# Altium schematic sheet 2015PCB新.SchDoc
size A3
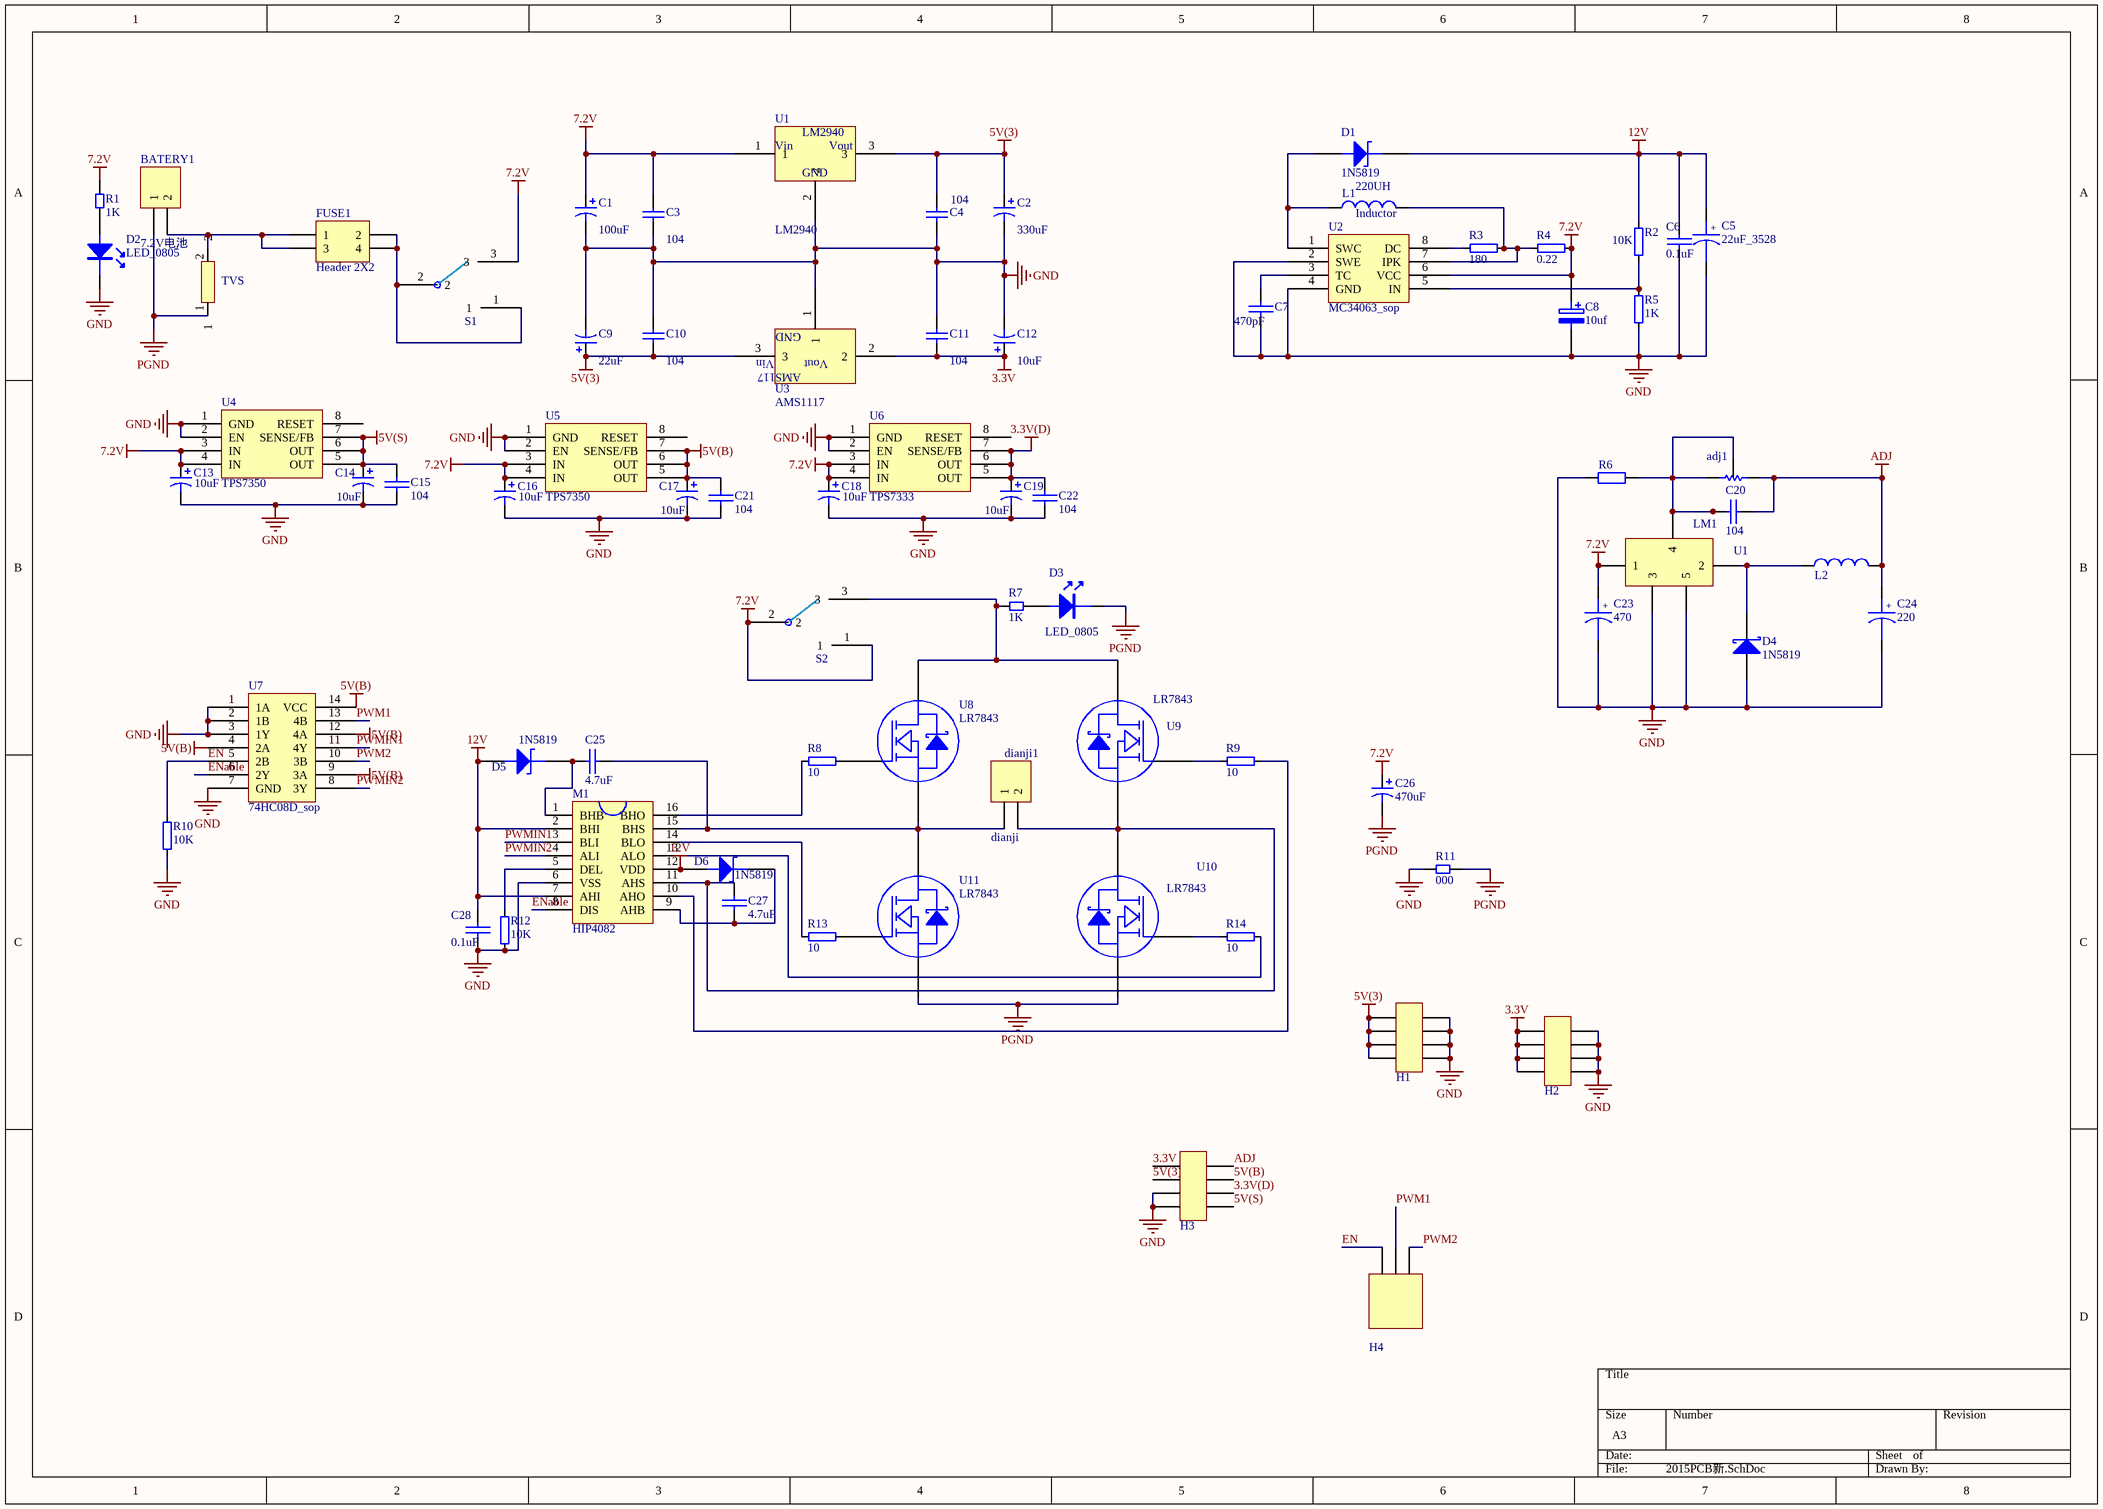
[diagram p0: 2015PCB新.SchDoc]

## Parts
adj1  RISISTR_ADJ  [RISIATER_ADJ]  (value not drawn)
BATERY1  7.2V电池  [PCBComponent_1]
C1  value 100uF  [PCBComponent_1]  (hidden comment: Cap Pol1_1)
C2  value 330uF  [PCBComponent_1]  (hidden comment: Cap Pol1_1)
C3  value 104  [PCBComponent_1]  (hidden comment: Cap)
C4  value 104  [PCBComponent_1]  (hidden comment: Cap)
C5  22uF_3528  [3528_B]
C6  0.1uF  [0805]
C7  470pF  [0805]
C8  10uf  [1206]
C9  value 22uF  [PCBComponent_1]  (hidden comment: Cap Pol1_1)
C10  value 104  [PCBComponent_1]  (hidden comment: Cap)
C11  value 104  [PCBComponent_1]  (hidden comment: Cap)
C12  value 10uF  [PCBComponent_1]  (hidden comment: Cap Pol1_1)
C13  10uF  [1206]
C14  10uF  [1206]
C15  104  [c0805]
C16  10uF  [1206]
C17  10uF  [1206]
C18  10uF  [1206]
C19  10uF  [1206]
C20  104  [0805]
C21  104  [c0805]
C22  104  [c0805]
C23  470  [PCBComponent_1]
C24  220  [PCBComponent_1]
C25  4.7uF  [0805]
C26  value 470uF  [PCBComponent_1]  (hidden comment: Cap Pol1_1)
C27  4.7uF  [0805]
C28  0.1uF  [0805]
D1  1N5819  [SS14_SMA]
D2  LED_0805  [0805]
D3  LED_0805  [0805]
D4  1N5819  [1N5819]
D5  1N5819  [SS14_SMA]
D6  1N5819  [SS14_SMA]
dianji1  dianji  [PCBComponent_1]
erjiguan1  TVS  [1812]
FUSE1  Header 2X2  [PCBComponent_1]
H1  HEADER4X2  [HEADER4X2]  (value not drawn)
H2  HEADER4X2  [HEADER4X2]  (value not drawn)
H3  HEADER4X2  [HEADER4X2]  (value not drawn)
H4  HEADER  [干簧管]  (value not drawn)
L1  Inductor  value 220UH  [PCBComponent_1]
L2  L?  [7*7*4]  (value not drawn)
LM1  U1  [LM2596]
M1  HIP4082  [SO-16]
R1  value 1K  [0805]  (hidden comment: RES)
R2  10K  [0805]
R3  180  [0805]
R4  0.22  [0805]
R5  1K  [0805]
R6  Res2  [0805]  (value not drawn)
R7  value 1K  [0805]  (hidden comment: RES)
R8  10  [0805]
R9  10  [0805]
R10  10K  [0805]
R11  value 000  [0805]  (hidden comment: RES)
R12  10K  [0805]
R13  10  [0805]
R14  10  [0805]
S1  单刀双掷开关  [三脚开关]  (value not drawn)
S2  单刀双掷开关  [三脚开关]  (value not drawn)
U1  LM2940  [PCBComponent_1]
U2  MC34063_sop  [SOP-8]
U3  AMS1117  [SOT223_forAMS1117]
U4  TPS7350  [SO-8]
U5  TPS7350  [SO-8]
U6  TPS7333  [SO-8]
U7  74HC08D_sop  [SOP-14]
U8  LR7843  [DPAK]
U9  LR7843  [DPAK]
U10  LR7843  [DPAK]
U11  LR7843  [DPAK]

## Nets
3.3V: C11.1 C12.1 H2.1 H2.2 H2.3 H2.4 H3.1 U3.2
3.3V(D): C19.1 C22.1 H3.6 U6.5(OUT) U6.6(OUT) U6.7(SENSE/FB)
5V(3): C2.1 C4.2 C9.1 C10.1 H1.1 H1.2 H1.3 H1.4 H3.2 U1.3 U3.3
5V(B): C17.1 C21.1 H3.7 U5.5(OUT) U5.6(OUT) U5.7(SENSE/FB) U7.4(2A) U7.9(3A) U7.12(4A) U7.14(VCC)
5V(S): C14.1 C15.1 H3.5 U4.5(OUT) U4.6(OUT) U4.7(SENSE/FB)
7.2V: C1.1 C3.2 C8.1 C13.1 C16.1 C18.1 C23.1 C26.1 LM1.1 R1.1 R4.2 S1.3 S2.1 S2.2 U1.1 U2.6(VCC) U4.3(IN) U4.4(IN) U5.3(IN) U5.4(IN) U6.3(IN) U6.4(IN)
12V: C5.1 C6.1 C28.1 D1.2(K) D5.1(A) D6.1(A) M1.2(BHI) M1.7(AHI) M1.12(VDD) R2.1
ADJ: adj1.3 C20.2 C24.1 H3.8 L2.2
GND: C1.2 C2.2 C3.1 C4.1 C5.2 C6.2 C7.2 C8.2 C9.2 C10.2 C11.2 C12.2 C13.2 C14.2 C15.2 C16.2 C17.2 C18.2 C19.2 C21.2 C22.2 C23.2 C24.2 C28.2 D2.2 D4.1 H1.5 H1.6 H1.7 H1.8 H2.5 H2.6 H2.7 H2.8 H3.3 H3.4 LM1.3 LM1.5 M1.6(VSS) R5.1 R6.1 R10.1 R11.1 R12.1 U1.2 U2.2(SWE) U2.4(GND) U3.1 U4.1(GND) U4.2(EN) U5.1(GND) U5.2(EN) U6.1(GND) U6.2(EN) U7.1(1A) U7.2(1B) U7.3(1Y) U7.7(GND)
PGND: BATERY1.1 C26.2 D3.2 R11.2 U10.3(S) U11.3(S)
EN: H4.3 R10.2 U7.5(2B)
ENable: M1.8(DIS) U7.6(2Y)
PWM1: H4.2 U7.13(4B)
PWM2: H4.1 U7.10(3B)
PWMIN1: M1.3(BLI) U7.11(4Y)
PWMIN2: M1.4(ALI) U7.8(3Y)
Netadj1_1: adj1.1 adj1.2 C20.1 LM1.4 R6.2
NetBATERY1_2: BATERY1.2 FUSE1.1 FUSE1.3
NetC7_1: C7.1 U2.3(TC)
NetC25_1: C25.1 dianji1.1 M1.15(BHS) U8.3(S) U11.2(D)
NetC25_2: C25.2 D5.2(K) M1.1(BHB)
NetC27_1: C27.1 dianji1.2 M1.11(AHS) U9.3(S) U10.2(D)
NetC27_2: C27.2 D6.2(K) M1.9(AHB)
NetD1_1: D1.1(A) L1.1 U2.1(SWC)
NetD2_1: D2.1 R1.2
NetD3_1: D3.1 R7.2
NetD4_2: D4.2 L2.1 LM1.2
NetFUSE1_2: FUSE1.2 FUSE1.4 S1.1 S1.2
NetL1_2: L1.2 R3.2 R4.1 U2.7(IPK)
NetM1_5: M1.5(DEL) R12.2
NetM1_10: M1.10(AHO) R9.2
NetM1_13: M1.13(ALO) R14.2
NetM1_14: M1.14(BLO) R13.1
NetM1_16: M1.16(BHO) R8.1
NetR2_2: R2.2 R5.2 U2.5(IN)
NetR3_1: R3.1 U2.8(DC)
NetR7_1: R7.1 S2.3 U8.2(D) U9.2(D)
NetR8_2: R8.2 U8.1(G)
NetR9_1: R9.1 U9.1(G)
NetR13_2: R13.2 U11.1(G)
NetR14_1: R14.1 U10.1(G)

Not connected (* = marked no-connect by the designer): erjiguan1 1 2; U4 8(RESET); U5 8(RESET); U6 8(RESET)

## Notes on the sheet
- (in symbol 10uF_3528) +
- (in symbol AMS1117) GND; Vin; Vout; AMS117
- (in symbol LM2940) Vin; Vout; GND
- (in symbol P_cap_C_100u) +

## Library data of the parts
BATERY1 dianji1 = Header 2: Header, 2-Pin; LatestRevisionDate: 17-Jul-2002; LatestRevisionNote: Re-released for DXP Platform.; Publisher: Altium Limited
C1 C2 C9 C12 C26 = Cap Pol1_1: Polarized Capacitor (Radial); Published: 8-Jun-2000; LatestRevisionDate: 17-Jul-2002; LatestRevisionNote: Re-released for DXP Platform.; PackageReference: RB7.6-15; Publisher: Altium Limited
C3 C4 C10 C11 = Cap: Capacitor; Published: 8-Jun-2000; LatestRevisionDate: 17-Jul-2002; LatestRevisionNote: Re-released for DXP Platform.; PackageReference: RAD-0.3; Publisher: Altium Limited
C5 = 10uF_3528
C6 C7 C25 C27 C28 = 0.1uF_0805
C8 = ELECTRO2_2: Electrolytic Capacitor
C13 C14 C16-C19 = Cap Pol1: Polarized Capacitor (Radial); Published: 8-Jun-2000; LatestRevisionDate: 17-Jul-2002; LatestRevisionNote: Re-released for DXP Platform.; PackageReference: RB7.6-15; Publisher: Altium Limited; Value: 10uF
C15 C21 C22 = CAP: Capacitor
C20 = CAP_1: Capacitor
C23 C24 = P_cap_C_100u
D1 D5 D6 = 1N5819_SMA
erjiguan1 = Component_1
FUSE1 = Header 2X2: Header, 2-Pin, Dual row; LatestRevisionDate: 17-Jul-2002; LatestRevisionNote: Re-released for DXP Platform.; Publisher: Altium Limited
H4 = HEADER3
L1 = Inductor: Code_IEC: 1005; Published: 8-Jun-2000; LatestRevisionDate: 29-May-2009; LatestRevisionNote: IPC-7351 Footprint Added.; PackageReference: 0402-A; Publisher: Altium Limited; PackageDescription: Chip Inductor; Code_JEITA: 0402
L2 = 33Uinductor774
LM1 = LM2596
R1 R7 R11 = 0805-电阻
R2-R5 R8-R10 R12-R14 = RES_0805
R6 = Res2: Resistor; Value: 0.22; Published: 8-Jun-2000; LatestRevisionDate: 17-Jul-2002; LatestRevisionNote: Re-released for DXP Platform.; PackageReference: AXIAL-0.4; Publisher: Altium Limited; PackageDescription: Axial Device, Thru-Hole; 2 Leads; 0.4 in Pin Spacing
U6 = TPS7350
U7 = 74HCT00D_sop
U8-U11 = IRF3205_D2PAK